# Altium schematic sheet FPGA_CAN_Misc.SchDoc
size A3
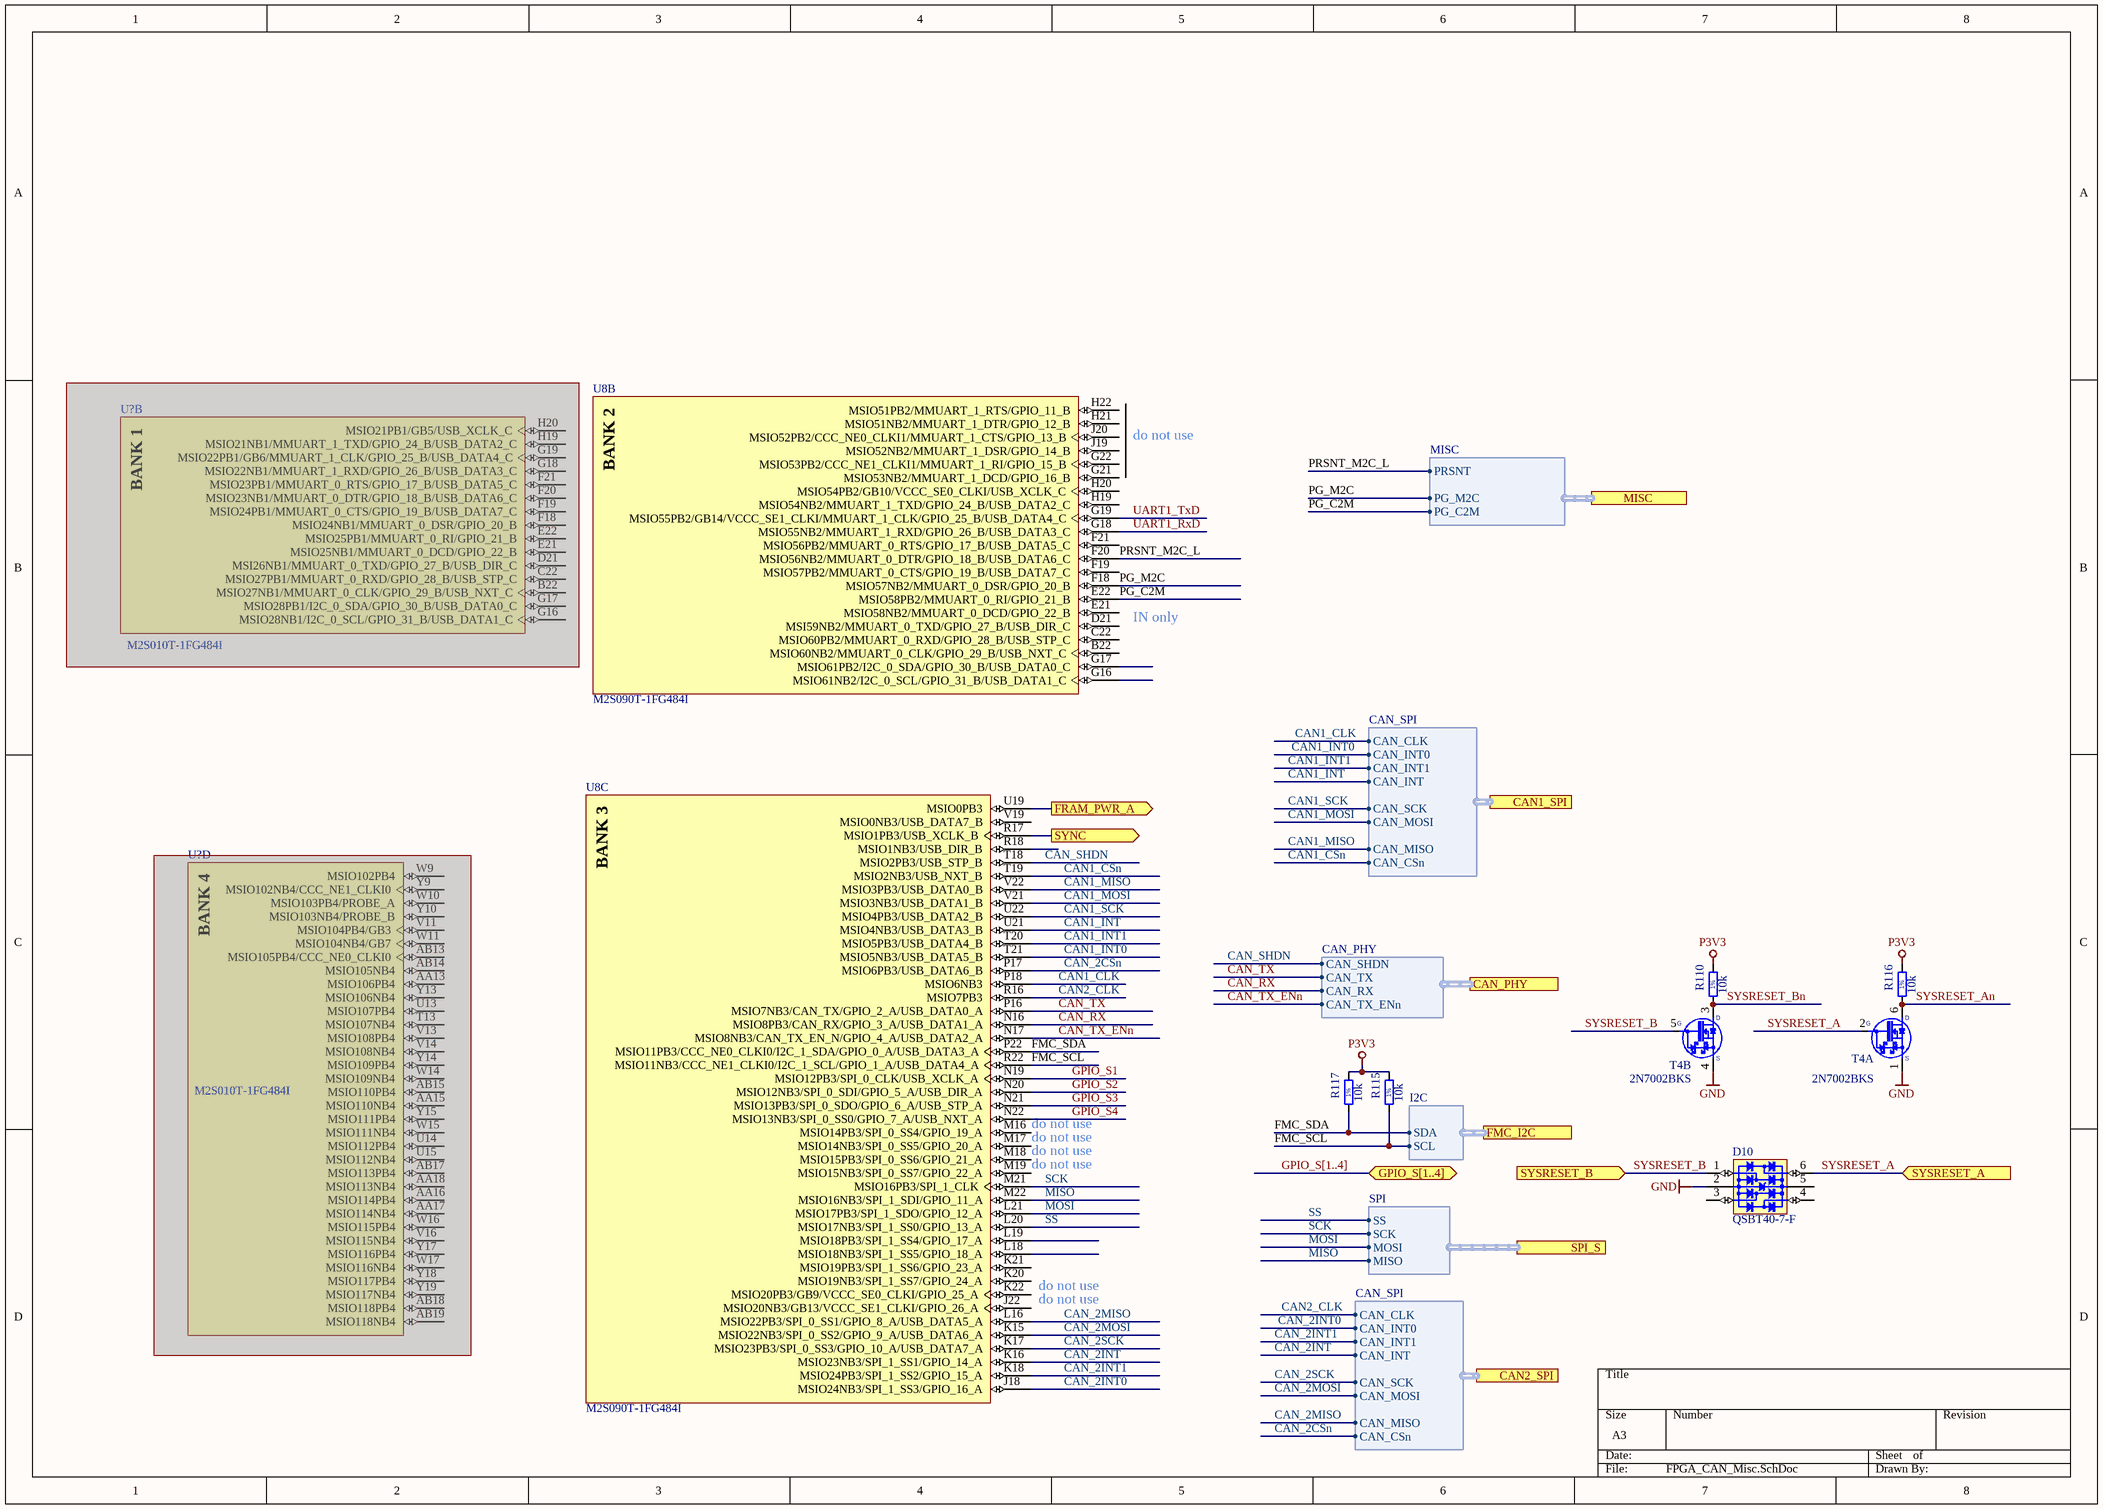
[diagram p0: FPGA_CAN_Misc.SchDoc]

## Parts
(Parts that share a designator on the sheet are numbered #1, #2 ... from top to bottom, then left to right.)
D10  QSBT40-7-F  [SOT65P210X110-6N]
R110  10k  [RESC1005X40N]
R115  10k  [RESC1005X40N]
R116  10k  [RESC1005X40N]
R117  10k  [RESC1005X40N]
T4  2N7002BKS  [SOT65P210X110-6N]  (parts A,B of 2)
U8  M2S090T-1FG484I  [MCSM-FG-484_V]  (parts B,C of 15)
U?#1  M2S010T-1FG484I  [MCSM-FG-484_V]  (part B of 16)  (masked out: inside a compile mask, not in the netlist)
U?#2  M2S010T-1FG484I  [MCSM-FG-484_V]  (part D of 16)  (masked out: inside a compile mask, not in the netlist)

## Ports
CAN1_SPI (harness CAN_SPI), CAN2_SPI (harness CAN_SPI), CAN_PHY (harness CAN_PHY), FMC_I2C (harness I2C), FRAM_PWR_A (out), GPIO_S[1..4] (bidir), MISC (harness MISC), SPI_S (harness SPI), SYNC (out), SYSRESET_A (in), SYSRESET_B (in)

## Harnesses
CAN_SPI: CAN_INT1, CAN_INT, CAN_INT0, CAN_SCK, CAN_MOSI, CAN_MISO, CAN_CSn, CAN_CLK
I2C: SCL, SDA
MISC: PRSNT, PG_M2C, PG_C2M
SPI: MISO, MOSI, SCK, SS
CAN_PHY: CAN_TX, CAN_RX, CAN_TX_ENn, CAN_SHDN

## Nets
GND: D10.2(GND) T4.1(S) T4.4(S)
P3V3: R110.2 R115.2 R116.2 R117.2
CAN1_CLK: U8.P18(MSIO6NB3) ; port CAN1_SPI.CAN_CLK
CAN1_CSn: U8.T19(MSIO2NB3/USB_NXT_B) ; port CAN1_SPI.CAN_CSn
CAN1_INT: U8.U21(MSIO4NB3/USB_DATA3_B) ; port CAN1_SPI.CAN_INT
CAN1_INT0: U8.T21(MSIO5NB3/USB_DATA5_B) ; port CAN1_SPI.CAN_INT0
CAN1_INT1: U8.T20(MSIO5PB3/USB_DATA4_B) ; port CAN1_SPI.CAN_INT1
CAN1_MISO: U8.V22(MSIO3PB3/USB_DATA0_B) ; port CAN1_SPI.CAN_MISO
CAN1_MOSI: U8.V21(MSIO3NB3/USB_DATA1_B) ; port CAN1_SPI.CAN_MOSI
CAN1_SCK: U8.U22(MSIO4PB3/USB_DATA2_B) ; port CAN1_SPI.CAN_SCK
CAN2_CLK: U8.R16(MSIO7PB3) ; port CAN2_SPI.CAN_CLK
CAN_2CSn: U8.P17(MSIO6PB3/USB_DATA6_B) ; port CAN2_SPI.CAN_CSn
CAN_2INT: U8.K16(MSIO23NB3/SPI_1_SS1/GPIO_14_A) ; port CAN2_SPI.CAN_INT
CAN_2INT0: U8.J18(MSIO24NB3/SPI_1_SS3/GPIO_16_A) ; port CAN2_SPI.CAN_INT0
CAN_2INT1: U8.K18(MSIO24PB3/SPI_1_SS2/GPIO_15_A) ; port CAN2_SPI.CAN_INT1
CAN_2MISO: U8.L16(MSIO22PB3/SPI_0_SS1/GPIO_8_A/USB_DATA5_A) ; port CAN2_SPI.CAN_MISO
CAN_2MOSI: U8.K15(MSIO22NB3/SPI_0_SS2/GPIO_9_A/USB_DATA6_A) ; port CAN2_SPI.CAN_MOSI
CAN_2SCK: U8.K17(MSIO23PB3/SPI_0_SS3/GPIO_10_A/USB_DATA7_A) ; port CAN2_SPI.CAN_SCK
CAN_RX: U8.N16(MSIO8PB3/CAN_RX/GPIO_3_A/USB_DATA1_A) ; port CAN_PHY.CAN_RX
CAN_SHDN: U8.T18(MSIO2PB3/USB_STP_B) ; port CAN_PHY.CAN_SHDN
CAN_TX: U8.P16(MSIO7NB3/CAN_TX/GPIO_2_A/USB_DATA0_A) ; port CAN_PHY.CAN_TX
CAN_TX_ENn: U8.N17(MSIO8NB3/CAN_TX_EN_N/GPIO_4_A/USB_DATA2_A) ; port CAN_PHY.CAN_TX_ENn
FMC_SCL: R115.1 U8.R22(MSIO11NB3/CCC_NE1_CLKI0/I2C_1_SCL/GPIO_1_A/USB_DATA4_A) ; port FMC_I2C.SCL
FMC_SDA: R117.1 U8.P22(MSIO11PB3/CCC_NE0_CLKI0/I2C_1_SDA/GPIO_0_A/USB_DATA3_A) ; port FMC_I2C.SDA
FRAM_PWR_A: U8.U19(MSIO0PB3) ; port FRAM_PWR_A
GPIO_S1: U8.N19(MSIO12PB3/SPI_0_CLK/USB_XCLK_A)
GPIO_S2: U8.N20(MSIO12NB3/SPI_0_SDI/GPIO_5_A/USB_DIR_A)
GPIO_S3: U8.N21(MSIO13PB3/SPI_0_SDO/GPIO_6_A/USB_STP_A)
GPIO_S4: U8.N22(MSIO13NB3/SPI_0_SS0/GPIO_7_A/USB_NXT_A)
MISO: U8.M22(MSIO16NB3/SPI_1_SDI/GPIO_11_A) ; port SPI_S.MISO
MOSI: U8.L21(MSIO17PB3/SPI_1_SDO/GPIO_12_A) ; port SPI_S.MOSI
PG_C2M: U8.E22(MSIO58PB2/MMUART_0_RI/GPIO_21_B) ; port MISC.PG_C2M
PG_M2C: U8.F18(MSIO57NB2/MMUART_0_DSR/GPIO_20_B) ; port MISC.PG_M2C
PRSNT_M2C_L: U8.F20(MSIO56NB2/MMUART_0_DTR/GPIO_18_B/USB_DATA6_C) ; port MISC.PRSNT
SCK: U8.M21(MSIO16PB3/SPI_1_CLK) ; port SPI_S.SCK
SS: U8.L20(MSIO17NB3/SPI_1_SS0/GPIO_13_A) ; port SPI_S.SS
SYNC: U8.R17(MSIO1PB3/USB_XCLK_B) ; port SYNC
SYSRESET_A: D10.6(I/O4) T4.2(G) ; port SYSRESET_A
SYSRESET_An: R116.1 T4.6(D)
SYSRESET_B: D10.1(I/O1) T4.5(G) ; port SYSRESET_B
SYSRESET_Bn: R110.1 T4.3(D)
UART1_RxD: U8.G18(MSIO55NB2/MMUART_1_RXD/GPIO_26_B/USB_DATA3_C)
UART1_TxD: U8.G19(MSIO55PB2/GB14/VCCC_SE1_CLKI/MMUART_1_CLK/GPIO_25_B/USB_DATA4_C)

Not connected (* = marked no-connect by the designer): D10 3(I/O2) 4(I/O3) 5(VBUS); U8 B22(MSIO60NB2/MMUART_0_CLK/GPIO_29_B/USB_NXT_C) C22(MSIO60PB2/MMUART_0_RXD/GPIO_28_B/USB_STP_C) D21(MSI59NB2/MMUART_0_TXD/GPIO_27_B/USB_DIR_C) E21(MSIO58NB2/MMUART_0_DCD/GPIO_22_B) F19(MSIO57PB2/MMUART_0_CTS/GPIO_19_B/USB_DATA7_C) F21(MSIO56PB2/MMUART_0_RTS/GPIO_17_B/USB_DATA5_C) G16(MSIO61NB2/I2C_0_SCL/GPIO_31_B/USB_DATA1_C) G17(MSIO61PB2/I2C_0_SDA/GPIO_30_B/USB_DATA0_C) G21(MSIO53NB2/MMUART_1_DCD/GPIO_16_B) G22(MSIO53PB2/CCC_NE1_CLKI1/MMUART_1_RI/GPIO_15_B) H19(MSIO54NB2/MMUART_1_TXD/GPIO_24_B/USB_DATA2_C) H20(MSIO54PB2/GB10/VCCC_SE0_CLKI/USB_XCLK_C) H21(MSIO51NB2/MMUART_1_DTR/GPIO_12_B) H22(MSIO51PB2/MMUART_1_RTS/GPIO_11_B) J19(MSIO52NB2/MMUART_1_DSR/GPIO_14_B) J20(MSIO52PB2/CCC_NE0_CLKI1/MMUART_1_CTS/GPIO_13_B) J22(MSIO20NB3/GB13/VCCC_SE1_CLKI/GPIO_26_A) K20(MSIO19NB3/SPI_1_SS7/GPIO_24_A) K21(MSIO19PB3/SPI_1_SS6/GPIO_23_A) K22(MSIO20PB3/GB9/VCCC_SE0_CLKI/GPIO_25_A) L18(MSIO18NB3/SPI_1_SS5/GPIO_18_A) L19(MSIO18PB3/SPI_1_SS4/GPIO_17_A) M16(MSIO14PB3/SPI_0_SS4/GPIO_19_A) M17(MSIO14NB3/SPI_0_SS5/GPIO_20_A) M18(MSIO15PB3/SPI_0_SS6/GPIO_21_A) M19(MSIO15NB3/SPI_0_SS7/GPIO_22_A) R18(MSIO1NB3/USB_DIR_B) V19(MSIO0NB3/USB_DATA7_B)

## Buses and harness runs
bus GPIO_S[1..4] = port GPIO_S[1..4]

## Notes on the sheet
- do not use
- IN only
- (near U8) do not use
- (in symbol CMP-0959-00045-1, part B) BANK 2
- (in symbol CMP-0959-00045-1, part C) BANK 3
- (in symbol CMP-0959-00069-1, part B) BANK 1
- (in symbol CMP-0959-00069-1, part D) BANK 4
- (in symbol R0402_10K_1%_0.0625W_100PPM) 1%

## Library data of the parts
D10 = D_TVS_QSBT40-7-F: Bonding: No; PressFit: No; Case: *; Component Kind: Standard; Component Type: Standard; ComponentHeigth: *; CreateDate: 2018-01-01; Device: QSBT40-7-F; Footprint: SOT363; HelpURL: *; LatestRevisionDate: 2018-01-01; Manufacturer: *; Manufacturer Part Number: QSBT40-7-F; Mounted: Yes; PackageDescription: *; Part Description: *; Part Number: *; Pin Count: 6; Sense: No; SMD: Yes; Socket: No; Value: *
R110 R115-R117 = R0402_10K_1%_0.0625W_100PPM: Resistor - 1%; Manufacturer: GENERIC; Part Description: General Purpose Thick Film Chip Resistor; Manufacturer1 Part Number: 232270671003L; TC: ±100ppm/°C; PressFit: No; Manufacturer Part Number: R0402_10K_1%_0.0625W_100PPM; Part Number: R0402_10K_1%_0.0625W_100PPM; Tolerance: ±1%; Value: 10k; Component Kind: Standard; Component Type: Standard; Pin Count: 2; Status: Not Recommended; Power: 0.0625W; Case: 0402; Mounted: Yes; Sense: No; Socket: No; SMD: Yes; Manufacturer1 Example: YAGEO PHYCOMP; Manufacturer1 ComponentHeight: 0.4mm; HelpURL: \\cern.ch\dfs\Applications\Altium\Datasheets\R0402_Phycomp_RC0402.pdf; Author: CERN DEM JLC; CreateDate: 03/12/2007; LatestRevisionDate: 17/10/2012
T4 = 2N7002BKS: 60V, 300mA Dual N-Channel Trench MOSFET; Manufacturer: NXP SEMICONDUCTORS; Manufacturer Part Number: 2N7002BKS6; PressFit: No; Bonding: No; Part Number: 2N7002BKS; Component Kind: Standard; Component Type: Standard; Device: 2N7002BKS; PackageDescription: SOT363, SC70-6, SOT, 0.65mm Pitch, 6 pin, 1.25mm W X 2.00mm L X 1.10mm H, IPC Medium Density; Part Description: 60 V, 300 mA Dual N-Channel Trench MOSFET; Pin Count: 4; Case: SOT363; Mounted: Yes; Socket: No; SMD: Yes; Sense: No; ComponentHeight: 1.1mm; HelpURL: \\cern.ch\dfs\Applications\Altium\Datasheets\2N7002BKS.pdf; Author: CERN DEM JLC; CreateDate: 2012-11-27; LatestRevisionDate: 2012-11-27
U8 = CMP-0959-00045-1: SmartFusion2 SoC FPGA, ARM Cortex-M3, 90 K LUTs, 267 User I/O, Transceiver Available, Design Security, Speed Grade 1, -40 to 100 degC, 484-Ball BGA; Manufacturer: Microsemi; Total User I/O: 267; PLLs and CCCs: 6; LSRAM 18K Blocks: 109; eNVM (K Bytes): 512; DDR Controllers (Count x Width): 1x18; Math Blocks (18x18): 84; Maximum Logic Elements: 86,316; eSRAM (K Bytes): 64; MSIOD (2.5V): 40; SERDES Lanes: 4; MSIO (3.3V): 157; Total RAM (K bits): 2074; DDRIO (2.5V): 70; uSRAM1K Blocks: 112; eSRAM (K Bytes) Non SECDED: 80; ComponentLink3URL: http://www.microsemi.com/document-portal/doc_download/131095-package-mechanical-drawings; DatasheetVersion: Rev. 5; ComponentLink3Description: Package Specification; ComponentLink1Description: Manufacturer URL; PackageReference: FG-484; RoHS: FALSE; ComponentLink1URL: http://www.microsemi.com/; Code_JEDEC: MS-034; Mounting Technology: Surface Mount; PackageDescription: 484-Ball Fine Pitch Plastic Ball Grid Array (FBGA), Body 23 x 23 mm, Pitch 1 mm; PackageVersion: Rev. 48, 11/2013; ComponentLink2URL: http://www.microsemi.com/document-portal/doc_download/130717-smartfusion2-datasheet; PartNumber: M2S090T-1FG484I; ComponentLink2Description: Datasheet; PartId: 1
U?#1 U?#2 = CMP-0959-00069-1: SmartFusion2 SoC FPGA, ARM Cortex-M3, 10 K LUTs, 233 User I/O, Transceiver Available, Design Security, Speed Grade 1, -40 to 100 degC, 484-Ball BGA; Manufacturer: Microsemi; MSIO (3.3V): 123; DDRIO (2.5V): 70; eSRAM (K Bytes): 64; uSRAM1K Blocks: 22; SERDES Lanes: 4; DDR Controllers (Count x Width): 1x18; MSIOD (2.5V): 40; Maximum Logic Elements: 12,084; eNVM (K Bytes): 256; PLLs and CCCs: 2; LSRAM 18K Blocks: 21; eSRAM (K Bytes) Non SECDED: 80; Total RAM (K bits): 400; Total User I/O: 233; PackageVersion: Rev. 48, 11/2013; ComponentLink3URL: http://www.microsemi.com/document-portal/doc_download/131095-package-mechanical-drawings; ComponentLink1Description: Manufacturer URL; DatasheetVersion: Rev. 5; RoHS: FALSE; ComponentLink2Description: Datasheet; Code_JEDEC: MS-034; ComponentLink3Description: Package Specification; ComponentLink2URL: http://www.microsemi.com/document-portal/doc_download/130717-smartfusion2-datasheet; PartNumber: M2S010T-1FG484I; ComponentLink1URL: http://www.microsemi.com/; Math Blocks (18x18): 22; Mounting Technology: Surface Mount; PackageDescription: 484-Ball Fine Pitch Plastic Ball Grid Array (FBGA), Body 23 x 23 mm, Pitch 1 mm; PackageReference: FG-484